# Altium schematic sheet Connector.SchDoc
size A3; SheetNumber: 1; SheetTotal: 9
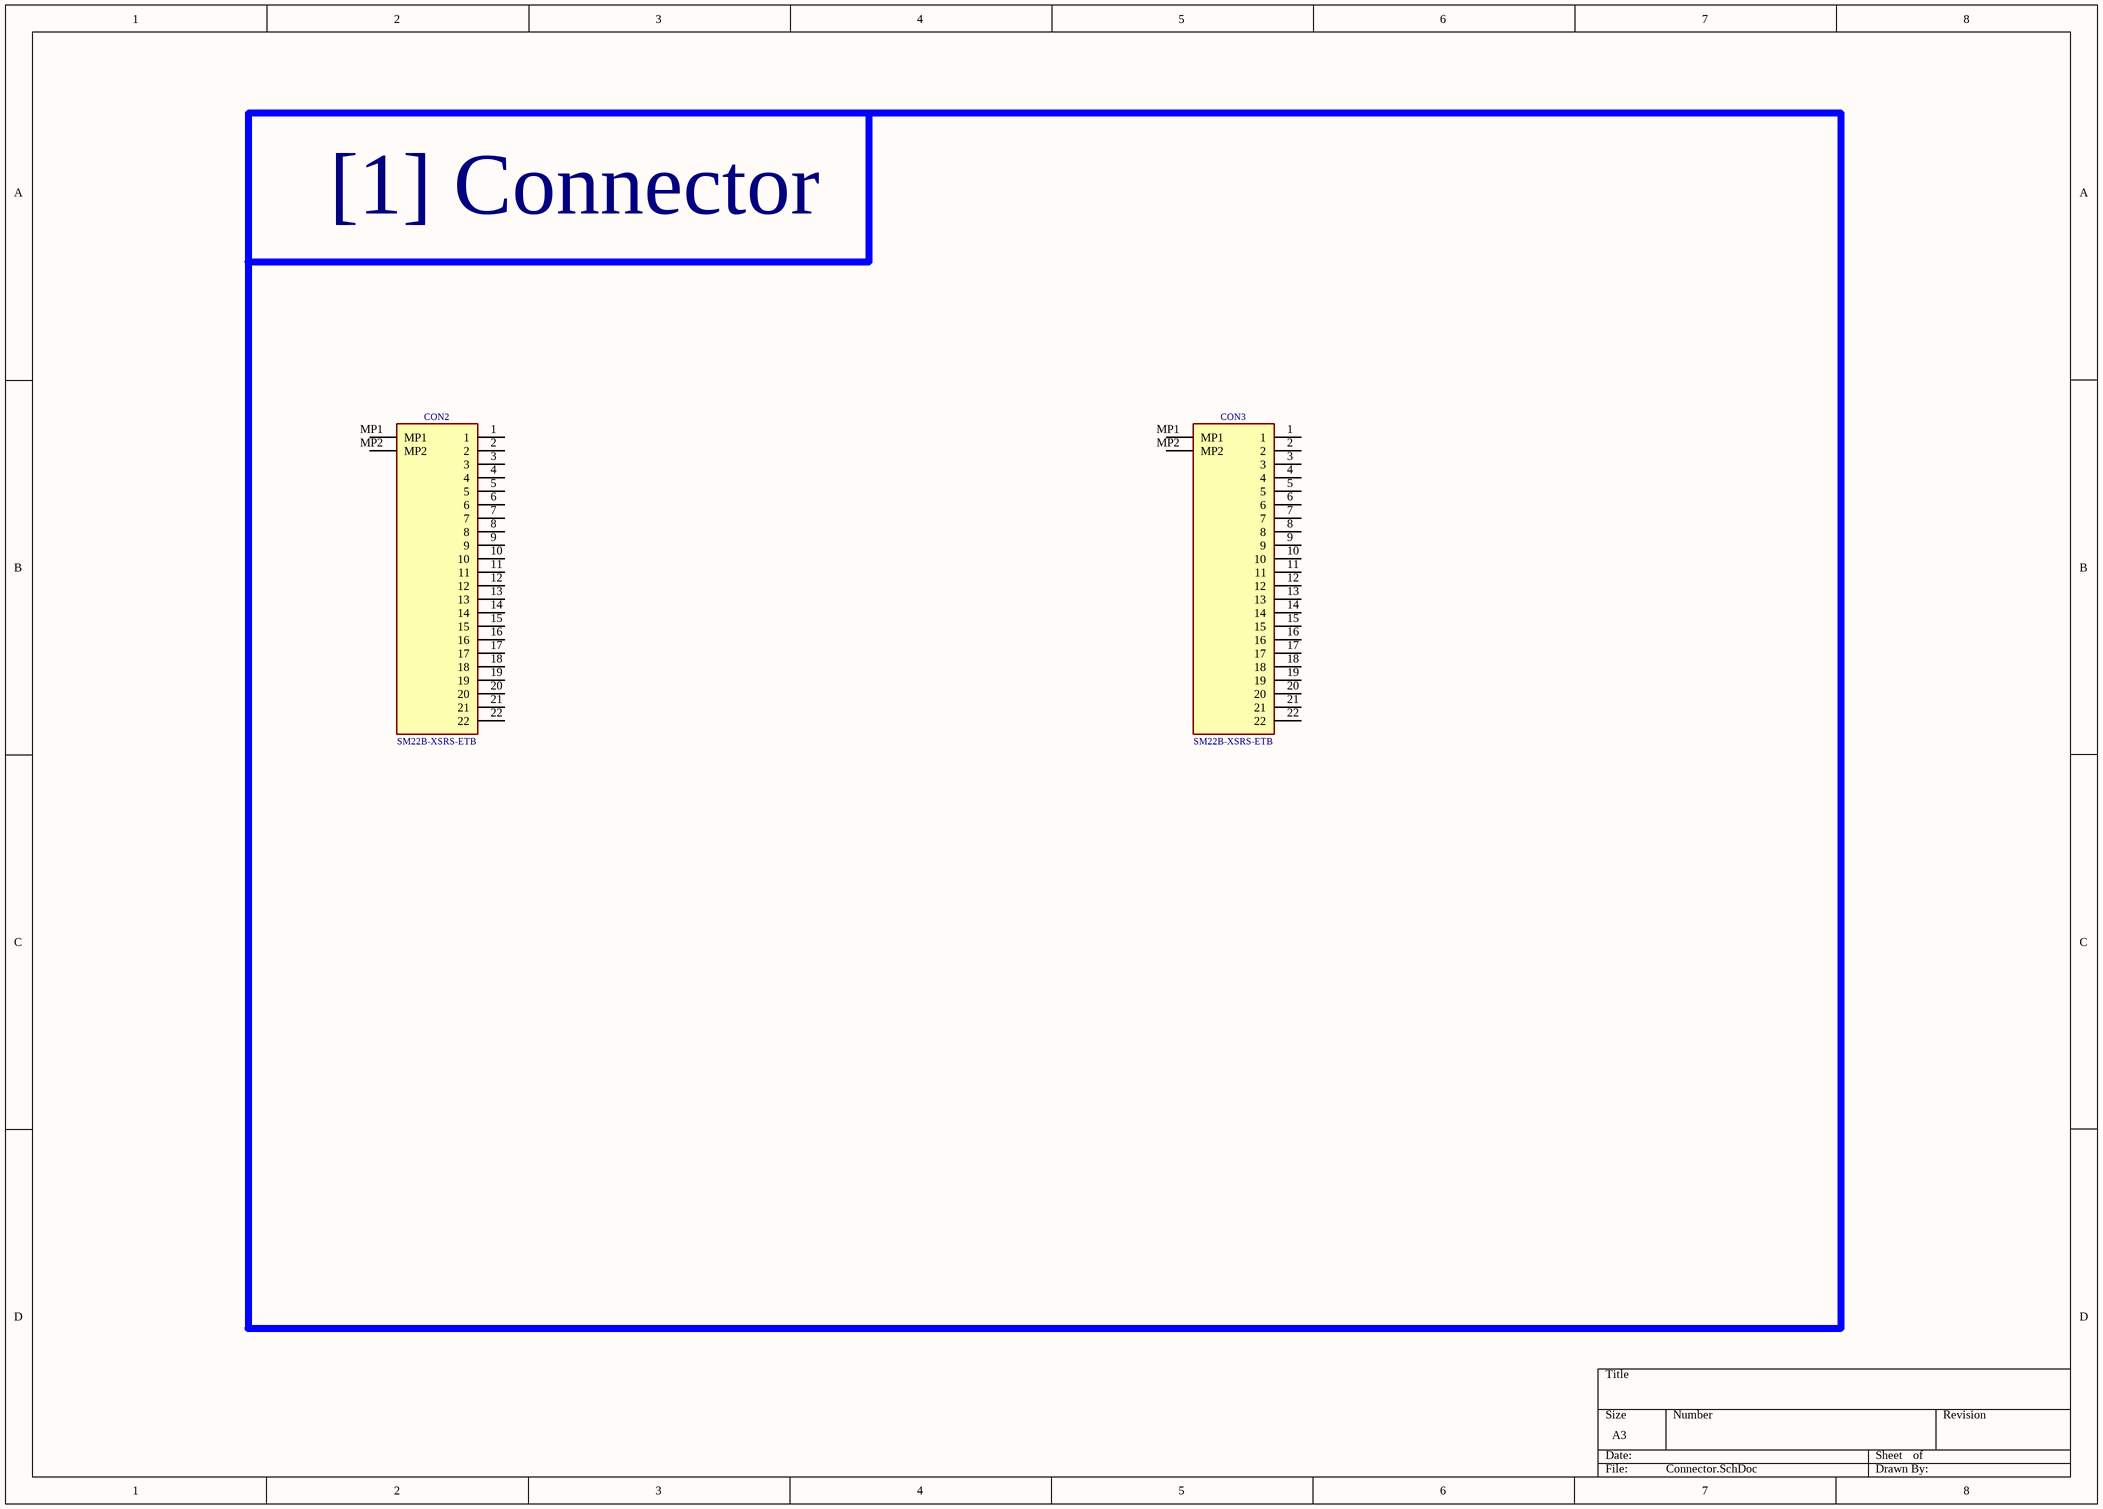
[diagram p0: Connector.SchDoc]

## Parts
CON2  SM22B-XSRS-ETB  [SM22B-XSRS-ETB]
CON3  SM22B-XSRS-ETB  [SM22B-XSRS-ETB]

## Blocks framed on the sheet
[1] Connector: CON2 CON3

## Nets

Not connected (* = marked no-connect by the designer): CON2 1 2 3 4 5 6 7 8 9 10 11 12 13 14 15 16 17 18 19 20 21 22 MP1 MP2; CON3 1 2 3 4 5 6 7 8 9 10 11 12 13 14 15 16 17 18 19 20 21 22 MP1 MP2

## Library data of the parts
CON2 CON3 = SM22B-XSRS-ETB: Jumper; Part_Number: J00001; ID: 110; Mounting_Type: SMT; Part_Name: Jumper; ComponentLink1Description: Datasheet